# EAGLE schematic Quadcopter (EAGLE 7.7.0)
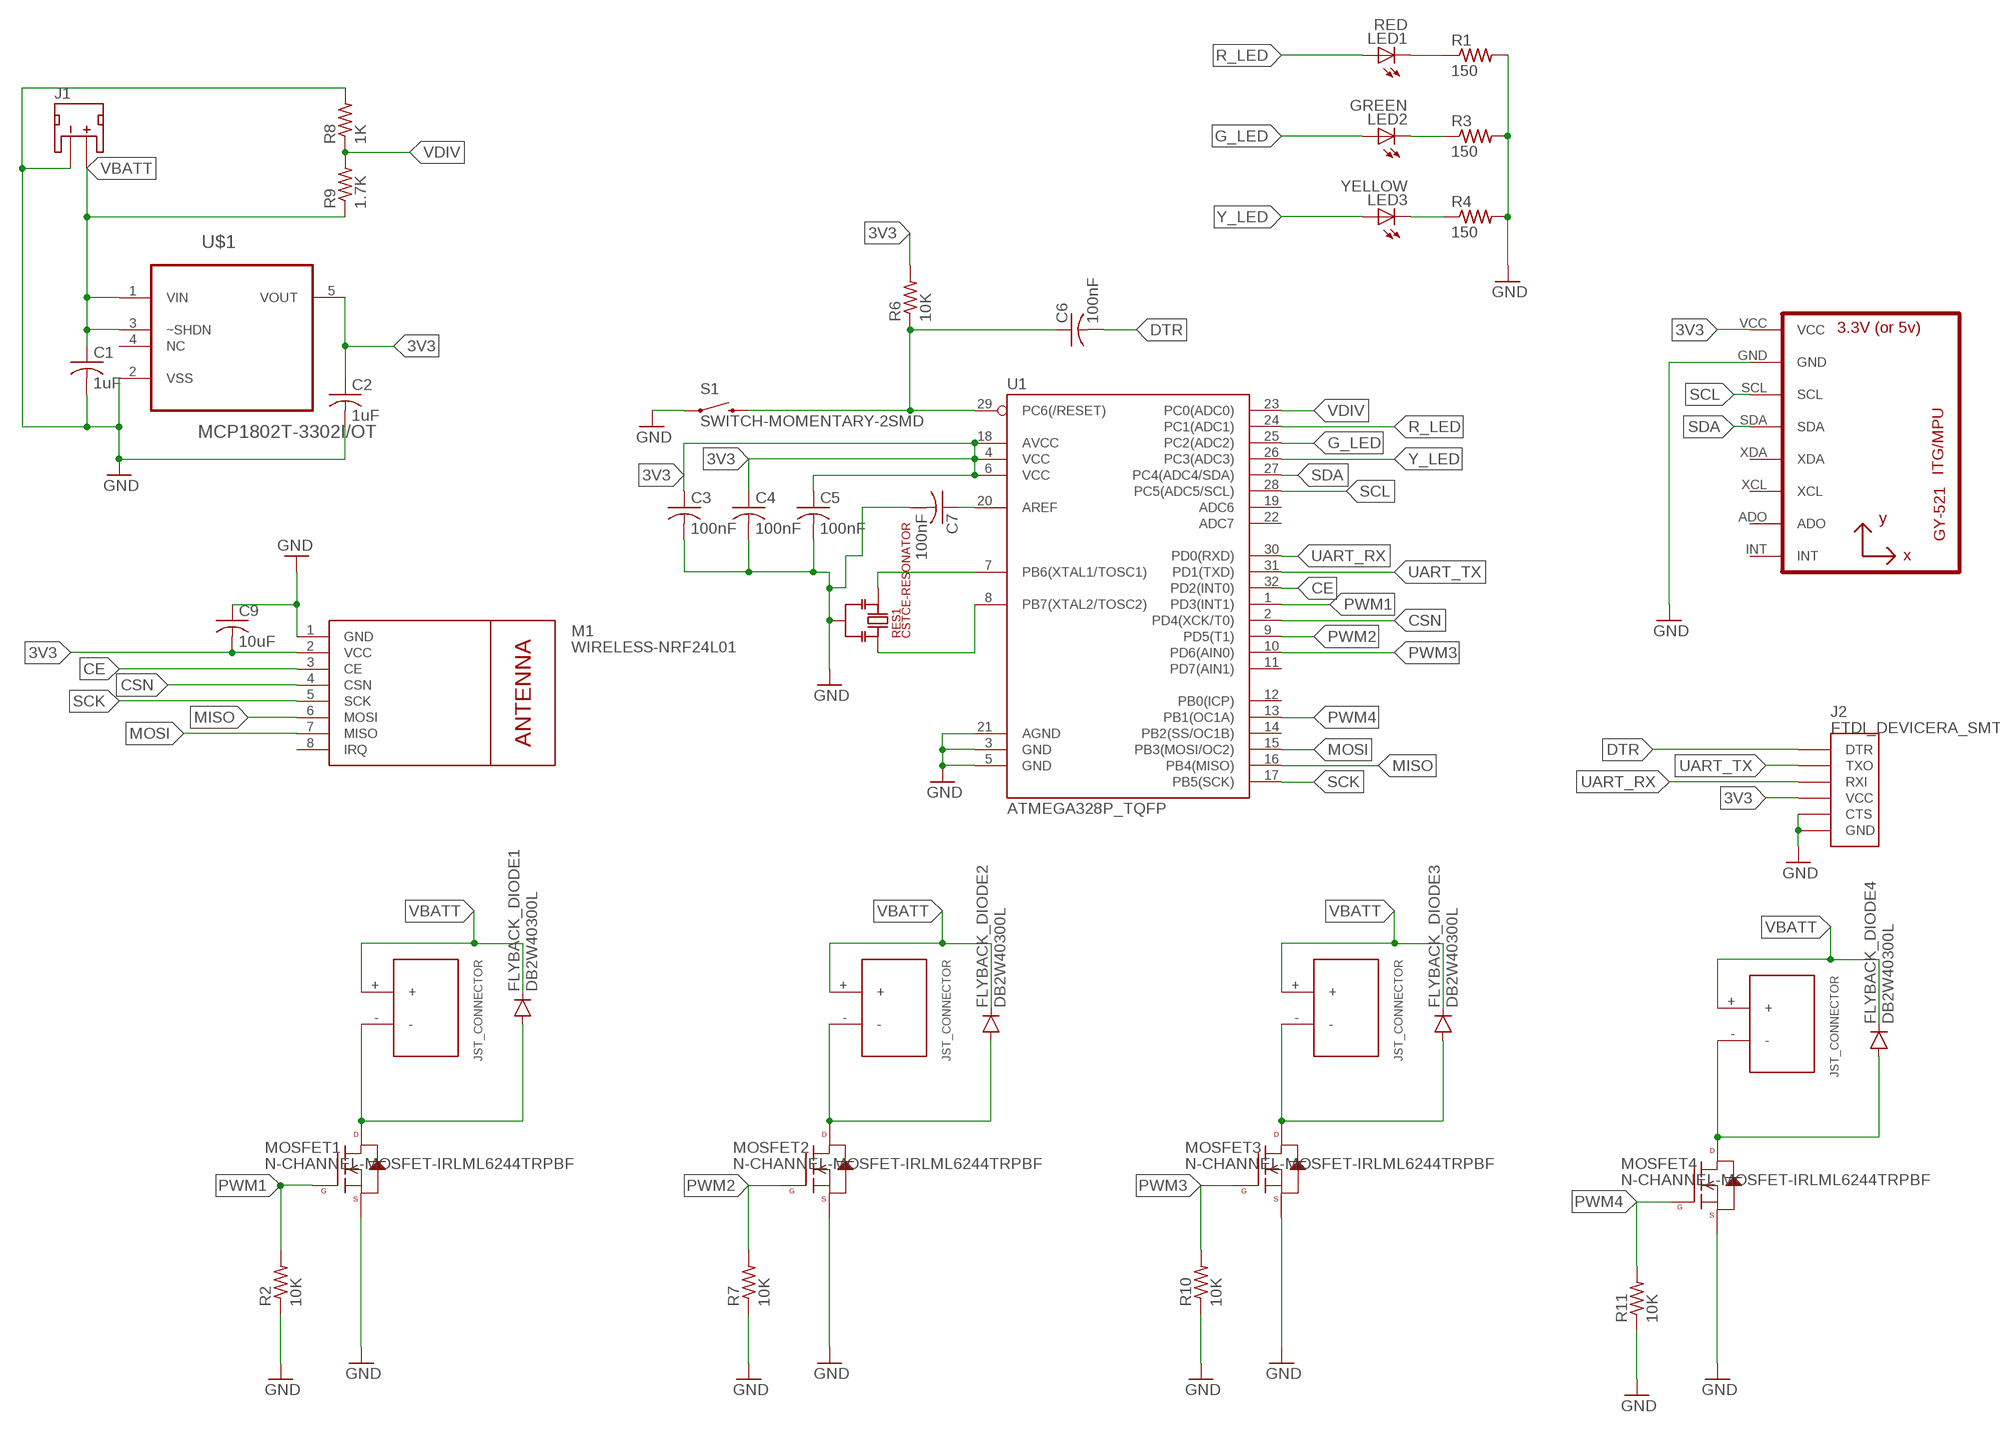
[diagram p0: schematic, sheet 1]

## Parts
C1  1uF  C-USC0603  [C0603]
C2  1uF  C-USC0603  [C0603]
C3  100nF  C-USC0603  [C0603]
C4  100nF  C-USC0603  [C0603]
C5  100nF  C-USC0603  [C0603]
C6  100nF  C-USC0603  [C0603]
C7  100nF  C-USC0603  [C0603]
C9  10uF  C-USC0603  [C0603]
FLYBACK_DIODE1  DB2W40300L  [MINI2-F3-B]
FLYBACK_DIODE2  DB2W40300L  [MINI2-F3-B]
FLYBACK_DIODE3  DB2W40300L  [MINI2-F3-B]
FLYBACK_DIODE4  DB2W40300L  [MINI2-F3-B]
J1  JST_2MM_MALE  [JST-2-SMD]
J2  FTDI_DEVICERA_SMT  [FTDI_DEVICE_RA_SMT]
LED1  RED  LEDCHIP-LED0603  [CHIP-LED0603]
LED2  GREEN  LEDCHIP-LED0603  [CHIP-LED0603]
LED3  YELLOW  LEDCHIP-LED0603  [CHIP-LED0603]
M1  WIRELESS-NRF24L01  [WIRELESS-NRF24L01]
MOSFET1  N-CHANNEL-MOSFET-IRLML6244TRPBF  [SOT23-3]
MOSFET2  N-CHANNEL-MOSFET-IRLML6244TRPBF  [SOT23-3]
MOSFET3  N-CHANNEL-MOSFET-IRLML6244TRPBF  [SOT23-3]
MOSFET4  N-CHANNEL-MOSFET-IRLML6244TRPBF  [SOT23-3]
MOTOR  JST_CONNECTOR_FEMALE  [JST_CONNECTOR_FEMALE]
MOTOR1  JST_CONNECTOR_FEMALE  [JST_CONNECTOR_FEMALE]
MOTOR2  JST_CONNECTOR_FEMALE  [JST_CONNECTOR_FEMALE]
MOTOR3  JST_CONNECTOR_FEMALE  [JST_CONNECTOR_FEMALE]
R1  150  R-US_R0603  [R0603]
R2  10K  R-US_R0603  [R0603]
R3  150  R-US_R0603  [R0603]
R4  150  R-US_R0603  [R0603]
R6  10K  R-US_R0603  [R0603]
R7  10K  R-US_R0603  [R0603]
R8  1K  R-US_R0603  [R0603]
R9  1.7K  R-US_R0603  [R0603]
R10  10K  R-US_R0603  [R0603]
R11  10K  R-US_R0603  [R0603]
RES1  CSTCE-RESONATOR  [CSTCE16M0V53-R0]
S1  SWITCH-MOMENTARY-2SMD  [TACTILE-SWITCH-SMD]
U1  ATMEGA328P_TQFP  [TQFP32-08]
U3  GY-521MPU6050  [GY-521]
U$1  MCP1802T-3302I/OT  MCP1802T-3002I/OT  [SOT95P270X145-5N]

## Nets
3V3: C2.1 C3.1 C4.1 C5.1 C9.2 J2.4(VCC) M1.2(VCC) R6.2 U1.4(VCC) U1.6(VCC) U1.18(AVCC) U3.VCC U$1.5(VOUT)
CE: M1.3(CE) U1.32(PD2(INT0))
CSN: M1.4(CSN) U1.2(PD4(XCK/T0))
DRAIN1: FLYBACK_DIODE1.POS(PPIN) MOSFET1.3(D) MOTOR.-
DRAIN2: FLYBACK_DIODE2.POS(PPIN) MOSFET2.3(D) MOTOR1.-
DRAIN3: FLYBACK_DIODE3.POS(PPIN) MOSFET3.3(D) MOTOR2.-
DRAIN4: FLYBACK_DIODE4.POS(PPIN) MOSFET4.3(D) MOTOR3.-
DTR: C6.2 J2.1(DTR)
G_LED: LED2.A U1.25(PC2(ADC2))
GND: C1.2 C2.2 C3.2 C4.2 C5.2 C7.2 C9.1 J1.1(-) J2.5(CTS) J2.6(GND) M1.1(GND) MOSFET1.2(S) MOSFET2.2(S) MOSFET3.2(S) MOSFET4.2(S) R1.2 R2.1 R3.2 R4.2 R7.1 R8.2 R10.1 R11.1 RES1.P$2 S1.1 U1.3(GND) U1.5(GND) U1.21(AGND) U3.GND U$1.2(VSS)
MISO: M1.6(MOSI) U1.16(PB4(MISO))
MOSI: M1.7(MISO) U1.15(PB3(MOSI/OC2))
N$1: C7.1 U1.20(AREF)
N$3: LED3.C R4.1
N$4: LED2.C R3.1
N$5: LED1.C R1.1
PWM1: MOSFET1.1(G) R2.2 U1.1(PD3(INT1))
PWM2: MOSFET2.1(G) R7.2 U1.9(PD5(T1))
PWM3: MOSFET3.1(G) R10.2 U1.10(PD6(AIN0))
PWM4: MOSFET4.1(G) R11.2 U1.13(PB1(OC1A))
R_LED: LED1.A U1.24(PC1(ADC1))
RST: C6.1 R6.1 S1.3 U1.29(PC6(/RESET))
SCK: M1.5(SCK) U1.17(PB5(SCK))
SCL: U1.28(PC5(ADC5/SCL)) U3.SCL
SDA: U1.27(PC4(ADC4/SDA)) U3.SDA
UART_RX: J2.3(RXI) U1.30(PD0(RXD))
UART_TX: J2.2(TXO) U1.31(PD1(TXD))
VBATT: C1.1 FLYBACK_DIODE1.NEG(GPIN) FLYBACK_DIODE2.NEG(GPIN) FLYBACK_DIODE3.NEG(GPIN) FLYBACK_DIODE4.NEG(GPIN) J1.2(+) MOTOR1.+ MOTOR2.+ MOTOR3.+ MOTOR.+ R9.1 U$1.1(VIN) U$1.3(~SHDN)
VDIV: R8.1 R9.2 U1.23(PC0(ADC0))
XTAL1: RES1.P$3 U1.7(PB6(XTAL1/TOSC1))
XTAL2: RES1.P$1 U1.8(PB7(XTAL2/TOSC2))
Y_LED: LED3.A U1.26(PC3(ADC3))
Unconnected: J1.NC1(PAD1) J1.NC2(PAD2) M1.8(IRQ) U1.11(PD7(AIN1)) U1.12(PB0(ICP)) U1.14(PB2(SS/OC1B)) U1.19(ADC6) U1.22(ADC7) U3.ADO U3.INT U3.XCL U3.XDA U$1.4(NC)

## Library data of the parts
C1-C7 C9 = rcl:C-US: CAPACITOR, American symbol
FLYBACK_DIODE1-FLYBACK_DIODE4 = quad:DB2W40300L
J1 = SparkFun-Connectors:JST_2MM_MALE: Mates to single-cell LiPo batteries. CONN-11443 Now with smashable polarity marks!; BTM_NEG: -; BTM_POS: +; PROD_ID: CONN-11443; TOP_NEG: -; TOP_POS: +
J2 = quad:FTDI_DEVICE: Connector which mates to FTDI basic or FTDI cable.; PROD_ID: CONN-08971
LED1-LED3 = led:LED: LED OSRAM: - CHIPLED LG R971, LG N971, LY N971, LG Q971, LY Q971, LO R971, LY R971 LH N974, LH R974 LS Q976, LO Q976, LY Q976 LO Q996 - Hyper CHIPLED LW Q18S LB Q993, LB Q99A, LB R99A - SideLED LS A670, LO A670, LY A670, LG A670, LP A670 LB A673, LV A673, LT A673, LW A673 LH A674 LY A675 LS A676, LA A676, LO A676, LY A676, LW A676 LS A679, LY A679, LG A679 - Hyper Micro SIDELED® LS Y876, LA Y876, LO Y876, LY Y876 LT Y87S - SmartLED LW L88C, LW L88S LB L89C, LB L89S, LG L890 LS L89K, LO L89K, LY L89K LS L896, LA L896, LO L896, LY L896 - TOPLED LS T670, LO T670, LY T670, LG T670, LP T670 LSG T670, LSP T670, LSY T670, LOP T670, LYG T670 LG T671, LOG T671, LSG T671 LB T673, LV T673, LT T673, LW T673 LH T674 LS T676, LA T676, LO T676, LY T676, LB T676, LH T676, LSB T676, LW T676 LB T67C, LV T67C, LT T67C, LS T67K, LO T67K, LY T67K, LW E67C LS E67B, LA E67B, LO E67B, LY E67B, LB E67C, LV E67C, LT E67C LW T67C LS T679, LY T679, LG T679 LS T770, LO T770, LY T770, LG T770, LP T770 LB T773, LV T773, LT T773, LW T773 LH T774 LS E675, LA E675, LY E675, LS T675 LS T776, LA T776, LO T776, LY T776, LB T776 LHGB T686 LT T68C, LB T68C - Hyper Mini TOPLED® LB M676 - Mini TOPLED Santana® LG M470 LS M47K, LO M47K, LY M47K Source: http://www.osram.convergy.de LUXEON: - LUMILED® LXK2-PW12-R00, LXK2-PW12-S00, LXK2-PW14-U00, LXK2-PW14-V00 LXK2-PM12-R00, LXK2-PM12-S00, LXK2-PM14-U00 LXK2-PE12-Q00, LXK2-PE12-R00, LXK2-PE12-S00, LXK2-PE14-T00, LXK2-PE14-U00 LXK2-PB12-K00, LXK2-PB12-L00, LXK2-PB12-M00, LXK2-PB14-N00, LXK2-PB14-P00, LXK2-PB14-Q00 LXK2-PR12-L00, LXK2-PR12-M00, LXK2-PR14-Q00, LXK2-PR14-R00 LXK2-PD12-Q00, LXK2-PD12-R00, LXK2-PD12-S00 LXK2-PH12-R00, LXK2-PH12-S00 LXK2-PL12-P00, LXK2-PL12-Q00, LXK2-PL12-R00 Source: www.luxeon.com KINGBRIGHT: KA-3528ASYC Source: www.kingbright.com
M1 = quad:WIRELESS-NRF24L01: 2.4 GHz Wireless Module based on NRF24L01 chip
MOSFET1-MOSFET4 = quad:N-CHANNEL-MOSFET: N-Channel MOSFET Mode Field Effect Transistor; DATASHEET: http://www.mouser.com/ds/2/196/irlml6244pbf-936666.pdf; MOUSER: 942-IRLML6244TRPBF; URL: http://www.mouser.com/Search/ProductDetail.aspx?R=IRLML6244TRPBFvirtualkey57370000virtualkey942-IRLML6244TRPBF
MOTOR MOTOR1-MOTOR3 = quad:JST_CONNECTOR_FEMALE
R1-R4 R6-R11 = rcl:R-US_: RESISTOR, American symbol
RES1 = quad:CSTCE-RESONATOR: Murata Electronics Resonator
S1 = quad:SWITCH-MOMENTARY-2: Various NO switches- pushbuttons, reed, etc; PROD_ID: SWCH-08247
U1 = quad:ATMEGA328P_TQFP; PROD_ID: IC-09069
U3 = quad:GY-521
U$1 = quad:MCP1802T-3002I/OT: Low Quiescent Current LDO; MPN: MCP1802T-3002I/OT; OC_FARNELL: 1578373; OC_NEWARK: 54M4837; PACKAGE: SOT-5; SUPPLIER: Microchip